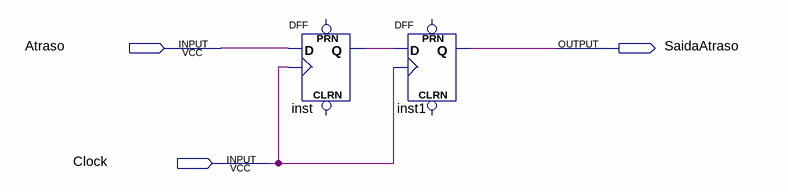
[diagram p0: schematic sheet]
// Quartus schematic AtrasoLimpar.bdf as structural Verilog: 2 symbols, 3 pins
module AtrasoLimpar (
  input  Atraso,
  input  Clock,
  output SaidaAtraso
);

  wire inst_q;

  DFF inst (.CLK(Clock), .D(Atraso), .Q(inst_q));  // open: CLRN, PRN
  DFF inst1 (.CLK(Clock), .D(inst_q), .Q(SaidaAtraso));  // open: CLRN, PRN
endmodule
